# EAGLE design beacon (EAGLE 6.5.0)
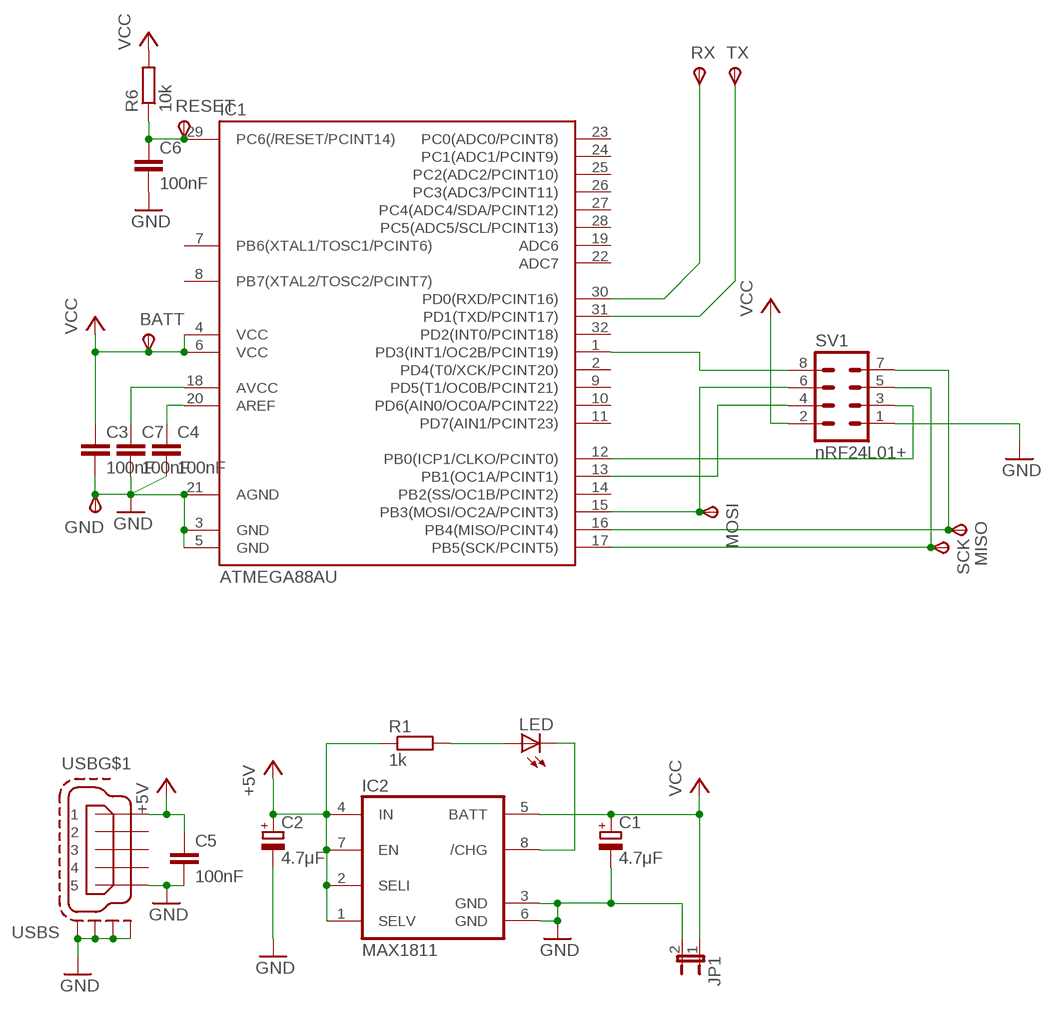
[diagram p0: schematic, sheet 1]

## Parts
BATT  TPSB1,27  [B1,27]
C1  4.7μF  CPOL-EUSMCC  [SMC_C]
C2  4.7μF  CPOL-EUSMCC  [SMC_C]
C3  100nF  C-EUC0805  [C0805]
C4  100nF  C-EUC0805  [C0805]
C5  100nF  C-EUC0805  [C0805]
C6  100nF  C-EUC0805  [C0805]
C7  100nF  C-EUC0805  [C0805]
GND  TPSB1,27  [B1,27]
IC1  ATMEGA88AU  MEGA48/88/168-AU  [TQFP32-08]
IC2  MAX1811  [SO08]
JP1  JP1E  [JP1]
LED  LEDCHIPLED_0805  [CHIPLED_0805]
MISO  TPSB1,27  [B1,27]
MOSI  TPSB1,27  [B1,27]
R1  1k  R-EU_M0805  [M0805]
R6  10k  R-EU_M0805  [M0805]
RESET  TPSB1,27  [B1,27]
RX  TPSB1,27  [B1,27]
SCK  TPSB1,27  [B1,27]
SV1  nRF24L01+  MA04-2  [MA04-2]
TX  TPSB1,27  [B1,27]
USB  MINI-USB-SCHIELD-32005-301  [32005-301]

## Nets
+5V: C2.+ C5.1 IC2.1(SELV) IC2.2(SELI) IC2.4(IN) IC2.7(EN) R1.1 USB.1
AREF: C4.1 IC1.20(AREF)
AVCC: C7.1 IC1.18(AVCC)
GND: C1.- C2.- C3.2 C4.2 C5.2 C6.2 C7.2 GND.TP(PP) IC1.3(GND) IC1.5(GND) IC1.21(AGND) IC2.3(GND) IC2.6(GND) JP1.2 SV1.1 USB.5 USB.M1(S:S1) USB.M2(S:S2) USB.M3(S:S3) USB.M4(S:S4)
INT1: IC1.1(PD3(INT1/OC2B/PCINT19)) SV1.8
MISO: IC1.16(PB4(MISO/PCINT4)) MISO.TP(PP) SV1.7
MOSI: IC1.15(PB3(MOSI/OC2A/PCINT3)) MOSI.TP(PP) SV1.6
N$3: LED.A R1.2
N$4: IC2.8(/CHG) LED.C
PB0: IC1.12(PB0(ICP1/CLKO/PCINT0)) SV1.3
PB1: IC1.13(PB1(OC1A/PCINT1)) SV1.4
RESET: C6.1 IC1.29(PC6(/RESET/PCINT14)) R6.1 RESET.TP(PP)
RX: IC1.30(PD0(RXD/PCINT16)) RX.TP(PP)
SCK: IC1.17(PB5(SCK/PCINT5)) SCK.TP(PP) SV1.5
TX: IC1.31(PD1(TXD/PCINT17)) TX.TP(PP)
VCC: BATT.TP(PP) C1.+ C3.1 IC1.4(VCC) IC1.6(VCC) IC2.5(BATT) JP1.1 R6.2 SV1.2
Unconnected: IC1.2(PD4(T0/XCK/PCINT20)) IC1.7(PB6(XTAL1/TOSC1/PCINT6)) IC1.8(PB7(XTAL2/TOSC2/PCINT7)) IC1.9(PD5(T1/OC0B/PCINT21)) IC1.10(PD6(AIN0/OC0A/PCINT22)) IC1.11(PD7(AIN1/PCINT23)) IC1.14(PB2(SS/OC1B/PCINT2)) IC1.19(ADC6) IC1.22(ADC7) IC1.23(PC0(ADC0/PCINT8)) IC1.24(PC1(ADC1/PCINT9)) IC1.25(PC2(ADC2/PCINT10)) IC1.26(PC3(ADC3/PCINT11)) IC1.27(PC4(ADC4/SDA/PCINT12)) IC1.28(PC5(ADC5/SCL/PCINT13)) IC1.32(PD2(INT0/PCINT18)) USB.2 USB.3 USB.4

## Library data of the parts
BATT GND MISO MOSI RESET RX SCK TX = testpad:TPS: TEST PIN
C1 C2 = rcl:CPOL-EU: POLARIZED CAPACITOR, European symbol
C3-C7 = rcl:C-EU: CAPACITOR, European symbol
IC1 = avr-7:MEGA48/88/168
IC2 = MAX1811:MAX1811: Maxim MAX1811 Li+ USB Charger
JP1 = jumper:JP1E: JUMPER
LED = led:LED: LED OSRAM: - CHIPLED LG R971, LG N971, LY N971, LG Q971, LY Q971, LO R971, LY R971 LH N974, LH R974 LS Q976, LO Q976, LY Q976 LO Q996 - Hyper CHIPLED LW Q18S LB Q993, LB Q99A, LB R99A - SideLED LS A670, LO A670, LY A670, LG A670, LP A670 LB A673, LV A673, LT A673, LW A673 LH A674 LY A675 LS A676, LA A676, LO A676, LY A676, LW A676 LS A679, LY A679, LG A679 - Hyper Micro SIDELED® LS Y876, LA Y876, LO Y876, LY Y876 LT Y87S - SmartLED LW L88C, LW L88S LB L89C, LB L89S, LG L890 LS L89K, LO L89K, LY L89K LS L896, LA L896, LO L896, LY L896 - TOPLED LS T670, LO T670, LY T670, LG T670, LP T670 LSG T670, LSP T670, LSY T670, LOP T670, LYG T670 LG T671, LOG T671, LSG T671 LB T673, LV T673, LT T673, LW T673 LH T674 LS T676, LA T676, LO T676, LY T676, LB T676, LH T676, LSB T676, LW T676 LB T67C, LV T67C, LT T67C, LS T67K, LO T67K, LY T67K, LW E67C LS E67B, LA E67B, LO E67B, LY E67B, LB E67C, LV E67C, LT E67C LW T67C LS T679, LY T679, LG T679 LS T770, LO T770, LY T770, LG T770, LP T770 LB T773, LV T773, LT T773, LW T773 LH T774 LS E675, LA E675, LY E675, LS T675 LS T776, LA T776, LO T776, LY T776, LB T776 LHGB T686 LT T68C, LB T68C - Hyper Mini TOPLED® LB M676 - Mini TOPLED Santana® LG M470 LS M47K, LO M47K, LY M47K Source: http://www.osram.convergy.de LUXEON: - LUMILED® LXK2-PW12-R00, LXK2-PW12-S00, LXK2-PW14-U00, LXK2-PW14-V00 LXK2-PM12-R00, LXK2-PM12-S00, LXK2-PM14-U00 LXK2-PE12-Q00, LXK2-PE12-R00, LXK2-PE12-S00, LXK2-PE14-T00, LXK2-PE14-U00 LXK2-PB12-K00, LXK2-PB12-L00, LXK2-PB12-M00, LXK2-PB14-N00, LXK2-PB14-P00, LXK2-PB14-Q00 LXK2-PR12-L00, LXK2-PR12-M00, LXK2-PR14-Q00, LXK2-PR14-R00 LXK2-PD12-Q00, LXK2-PD12-R00, LXK2-PD12-S00 LXK2-PH12-R00, LXK2-PH12-S00 LXK2-PL12-P00, LXK2-PL12-Q00, LXK2-PL12-R00 Source: www.luxeon.com KINGBRIGHT: KA-3528ASYC Source: www.kingbright.com
R1 R6 = rcl:R-EU_: RESISTOR, European symbol
SV1 = con-lstb:MA04-2: PIN HEADER; OC_FARNELL: unknown; OC_NEWARK: unknown
USB = con-cypressindustries:MINI-USB-SCHIELD-: MINI USB-B Conector Source: www.cypressindustries.com; OC_FARNELL: unknown; OC_NEWARK: unknown

## Board
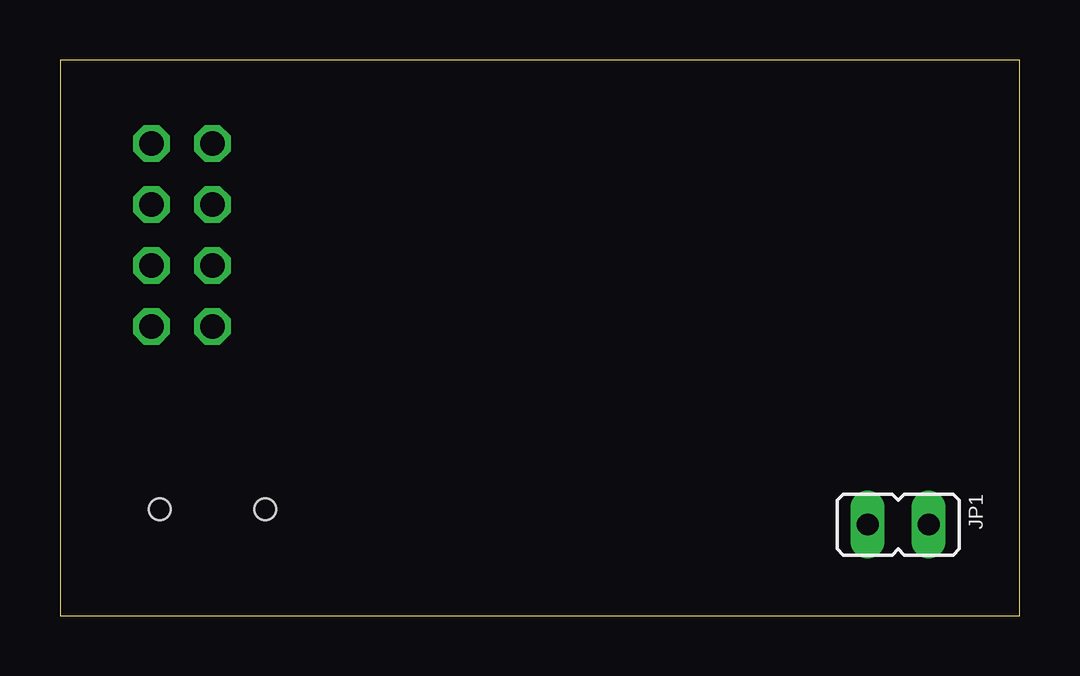
[diagram p1: board, top side]
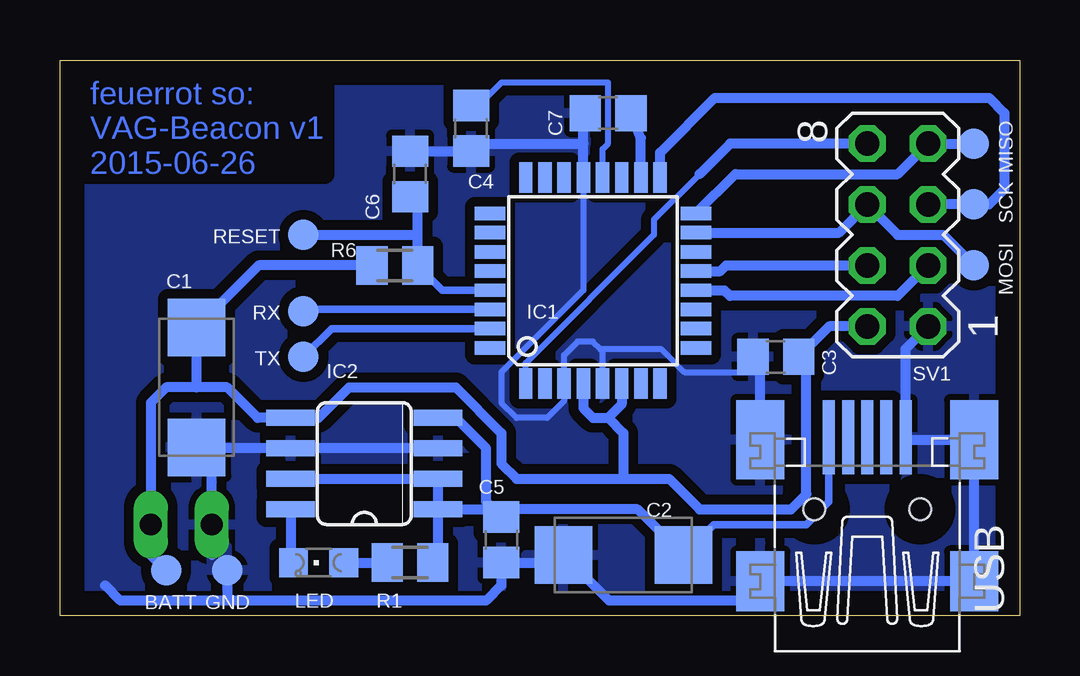
[diagram p2: board, bottom side, seen from below]

Size 39.98 x 23.16 mm. Coordinates in mm from the lower left corner, seen from the top.
Outline: 0,0 39.98,0 39.98,23.16 0,23.16 0,0
Copper layers (1*16): Top 0.035mm / dielectric 1.5mm / Bottom 0.035mm
Design rules "default *": minimum track width 10mil, minimum drill 24mil, track to track 16mil, track to pad 16mil, pad to pad 14mil, via to via 14mil, smd to smd 8mil, copper to edge 40mil, drill to drill 8mil, minimum pad ring 10mil, minimum via ring 8mil, stop-mask expansion 4mil, vias tented up to drill 0mil, thermal gap 10mil

### Footprints (pad centres in the part's own frame; a part is rotated, then mirrored left to right if it is on the bottom)
B1,27 = smd 1.27 x 1.27: TP 0,0
SMC_C = smd 2.4 x 2.4: + -2.5,0; - 2.5,0
C0805 = smd 1.3 x 1.5: 1 -0.95,0; 2 0.95,0
TQFP32-08 = smd 1.27 x 0.559: 1 -4.293,2.8; 2 -4.293,2; 3 -4.293,1.2; 4 -4.293,0.4; 5 -4.293,-0.4; 6 -4.293,-1.2; 7 -4.293,-2; 8 -4.293,-2.8; 17 4.293,-2.8; 18 4.293,-2; 19 4.293,-1.2; 20 4.293,-0.4; 21 4.293,0.4; 22 4.293,1.2; 23 4.293,2; 24 4.293,2.8 | smd 0.559 x 1.27: 9 -2.8,-4.293; 10 -2,-4.293; 11 -1.2,-4.293; 12 -0.4,-4.293; 13 0.4,-4.293; 14 1.2,-4.293; 15 2,-4.293; 16 2.8,-4.293; 25 2.8,4.293; 26 2,4.293; 27 1.2,4.293; 28 0.4,4.293; 29 -0.4,4.293; 30 -1.2,4.293; 31 -2,4.293; 32 -2.8,4.293
SO08 = smd 0.66 x 2.032: 1 -1.905,-3.073; 2 -0.635,-3.073; 3 0.635,-3.073; 4 1.905,-3.073; 5 1.905,3.073; 6 0.635,3.073; 7 -0.635,3.073; 8 -1.905,3.073
JP1 = drill 0.914 long: 1 0,-1.27; 2 0,1.27
CHIPLED_0805 = smd 1.2 x 1.2: A 0,-1.05; C 0,1.05
M0805 = smd 1.3 x 1.6: 1 -0.95,0; 2 0.95,0
MA04-2 = drill 1.016 octagon: 1 -3.81,-1.27; 2 -3.81,1.27; 3 -1.27,-1.27; 4 -1.27,1.27; 5 1.27,-1.27; 6 1.27,1.27; 7 3.81,-1.27; 8 3.81,1.27
32005-301 = smd 3.1 x 0.5: 1 3,1.6; 2 3,0.8; 3 3,0; 4 3,-0.8; 5 3,-1.6 | smd 2.5 x 2: M1 -3,-4.45; M2 -3,4.45 | smd 3.3 x 2: M3 2.9,4.45; M4 2.9,-4.45 | hole 0.9: 0,2.2; 0,-2.2

### Placement (x,y rotation side)
BATT  35.56,1.91 0 bottom
C1  34.29,9.53 270 bottom
C2  16.51,2.54 180 bottom
C3  10.16,10.79 180 bottom
C4  22.86,20.32 270 bottom
C5  21.59,3.17 270 bottom
C6  25.4,18.41 90 bottom
C7  17.14,20.95 180 bottom
GND  33.02,1.91 0 bottom
IC1  17.78,13.97 90 bottom
IC2  27.3,6.35 90 bottom
JP1  34.92,3.81 90 top
LED  29.21,2.22 90 bottom
MISO  1.91,19.68 0 bottom
MOSI  1.91,14.61 0 bottom
R1  25.4,2.22 180 bottom
R6  26.04,14.61 180 bottom
RESET  29.84,15.88 0 bottom
RX  29.84,12.7 0 bottom
SCK  1.91,17.14 0 bottom
SV1  5.08,15.88 90 bottom
TX  29.84,10.79 0 bottom
USB  6.35,4.45 90 bottom

### Tracks (layer width: path | path; a pad name or v marks a point on that pad's centre or on a via)
+5V
  Bottom 0.305: USB.1 7.95,4.75 8.89,3.81 12.74,3.81 C2.+
  Bottom 0.406: IC2.7 IC2.2 IC2.1 | IC2.4 23.5,8.26 22.23,6.99 22.23,4.76 22.07,4.6 | 22.07,4.6 C5.1 21.27,4.45 15.91,4.45 C2.+ | IC2.1 22.23,4.45 22.07,4.6 | R1.1 24.23,2.12 IC2.1
AREF
  Bottom 0.254: IC1.20 17.38,19.45 17.14,19.68 17.14,22.23 21.59,22.23 22.55,21.27 C4.1
AVCC
  Bottom 0.406: IC1.18 15.78,19.91 C7.1
GND
  Bottom 0.254: IC1.5 17.38,11.03 17.46,11.11 | 17.46,11.11 17.78,11.43 18.41,11.43 18.98,10.87 IC1.3 18.98,8.96 19.68,8.26 20.95,8.26 21.59,8.89 21.59,10.16 18.18,13.57 IC1.21 | C3.2 10.79,10.79 | 17.46,11.11 14.92,11.11 13.97,10.16 10.8,10.16
  Bottom 0.406: IC1.21 18.18,19.68 | 18.18,19.68 18.18,20.23 C7.2 | USB.M3 10.8,10.16 10.8,10.48 C3.2 | C6.2 C4.2 22.54,19.37 22.23,19.68 18.18,19.68 | SV1.1 4.75,11.12 USB.5 4.65,7.34 USB.M4 USB.M1 USB.M2 10.8,0.64 17.11,0.64 C2.- 19.32,2.23 C5.2 21.59,1.27 22.23,0.64 33.02,0.64 | IC2.3 IC2.6 34.25,6.99 C1.- 33.66,6.39 JP1.2 33.66,2.54 | 33.02,0.64 37.47,0.64 38.1,1.27 | GND.TP 33.02,0.64
  pour Bottom: 0,24.13 40.64,24.13 40.64,0 0,0
INT1
  Bottom 0.254: 13.34,18.41 15.24,16.51 15.24,15.88 20.58,10.54 IC1.1
  Bottom 0.406: SV1.8 12.06,19.68 13.34,18.41
MISO
  Bottom 0.406: MISO.TP SV1.7 5.08,18.41 11.84,18.41 IC1.16
MOSI
  Bottom 0.406: IC1.15 7.53,15.97 SV1.6 5.08,15.88 3.17,15.88 MOSI.TP
N$3
  Bottom 0.406: LED.A R1.2
N$4
  Bottom 0.406: IC2.8 30.38,2.02 LED.C
PB0
  Bottom 0.406: IC1.12 12.3,13.57 12.06,13.34 5.08,13.34 SV1.3
PB1
  Bottom 0.406: IC1.13 12.46,14.37 12.23,14.61 SV1.4
RESET
  Bottom 0.305: IC1.29 24.05,13.57 R6.1
  Bottom 0.406: R6.1 25.09,15.88 | 25.09,15.88 25.09,17.15 C6.1 | RESET.TP 25.09,15.88
RX
  Bottom 0.305: IC1.30 29.77,12.77 RX.TP
SCK
  Bottom 0.406: SV1.5 SCK.TP 1.27,17.14 0.64,17.78 0.64,20.95 1.27,21.59 12.7,21.59 14.98,19.31 IC1.17
TX
  Bottom 0.305: IC1.31 28.67,11.97 TX.TP
VCC
  Bottom 0.406: SV1.2 7.94,12.06 C3.1 8.89,10.47 8.89,5.08 9.53,4.45 13.34,4.45 14.61,5.71 16.51,5.71 | 16.51,5.71 20.95,5.71 21.59,6.35 21.59,7.62 23.5,9.53 27.94,9.53 29.21,8.26 IC2.5 31.75,8.26 33.02,9.53 34.29,9.53 | IC1.4 18.18,8.65 17.78,8.26 17.14,8.26 | 17.14,8.26 16.51,7.62 16.51,5.71 | IC1.6 16.58,8.82 17.14,8.26 | 34.29,9.53 C1.+ 31.71,14.61 R6.2 | 34.29,9.53 35.56,9.53 36.2,8.89 JP1.1 36.2,2.54 BATT.TP

### Text on the board
Bottom: feuerrot so: / VAG-Beacon v1 / 2015-06-26